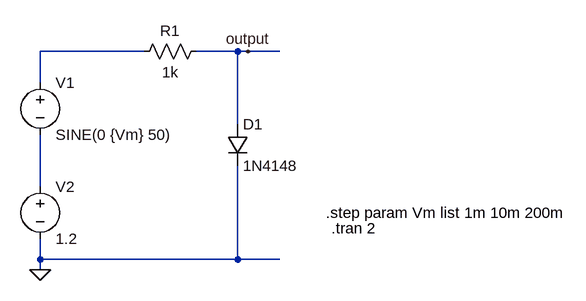
[diagram p0: schematic 2c.asc]
2c.asc, the LTspice schematic file:
Version 4
SHEET 1 964 680
WIRE 304 144 144 144
WIRE 448 144 384 144
WIRE 464 144 448 144
WIRE 512 144 464 144
WIRE 144 192 144 144
WIRE 448 256 448 144
WIRE 144 352 144 272
WIRE 144 464 144 432
WIRE 448 464 448 320
WIRE 448 464 144 464
WIRE 512 464 448 464
WIRE 144 480 144 464
FLAG 464 144 output
FLAG 144 480 0
SYMBOL voltage 144 176 R0
SYMATTR InstName V1
SYMATTR Value SINE(0 {Vm} 50)
SYMBOL voltage 144 336 R0
SYMATTR InstName V2
SYMATTR Value 1.2
SYMBOL res 400 128 R90
WINDOW 0 0 56 VBottom 2
WINDOW 3 32 56 VTop 2
SYMATTR InstName R1
SYMATTR Value 1k
SYMBOL diode 432 256 R0
SYMATTR InstName D1
SYMATTR Value 1N4148
TEXT 584 392 Left 2 !.step param Vm list 1m 10m 200m
TEXT 592 416 Left 2 !.tran 2

The netlist it stands for:
* 2c.asc
V1 N001 N002 SINE(0 {Vm} 50)
V2 N002 0 1.2
R1 output N001 1k
D1 output 0 1N4148
.model D D
.lib standard.dio
.step param Vm list 1m 10m 200m
.tran 2
.backanno
.end